# Altium schematic sheet Power.SchDoc
size A; SheetNumber: 3; SheetTotal: 3
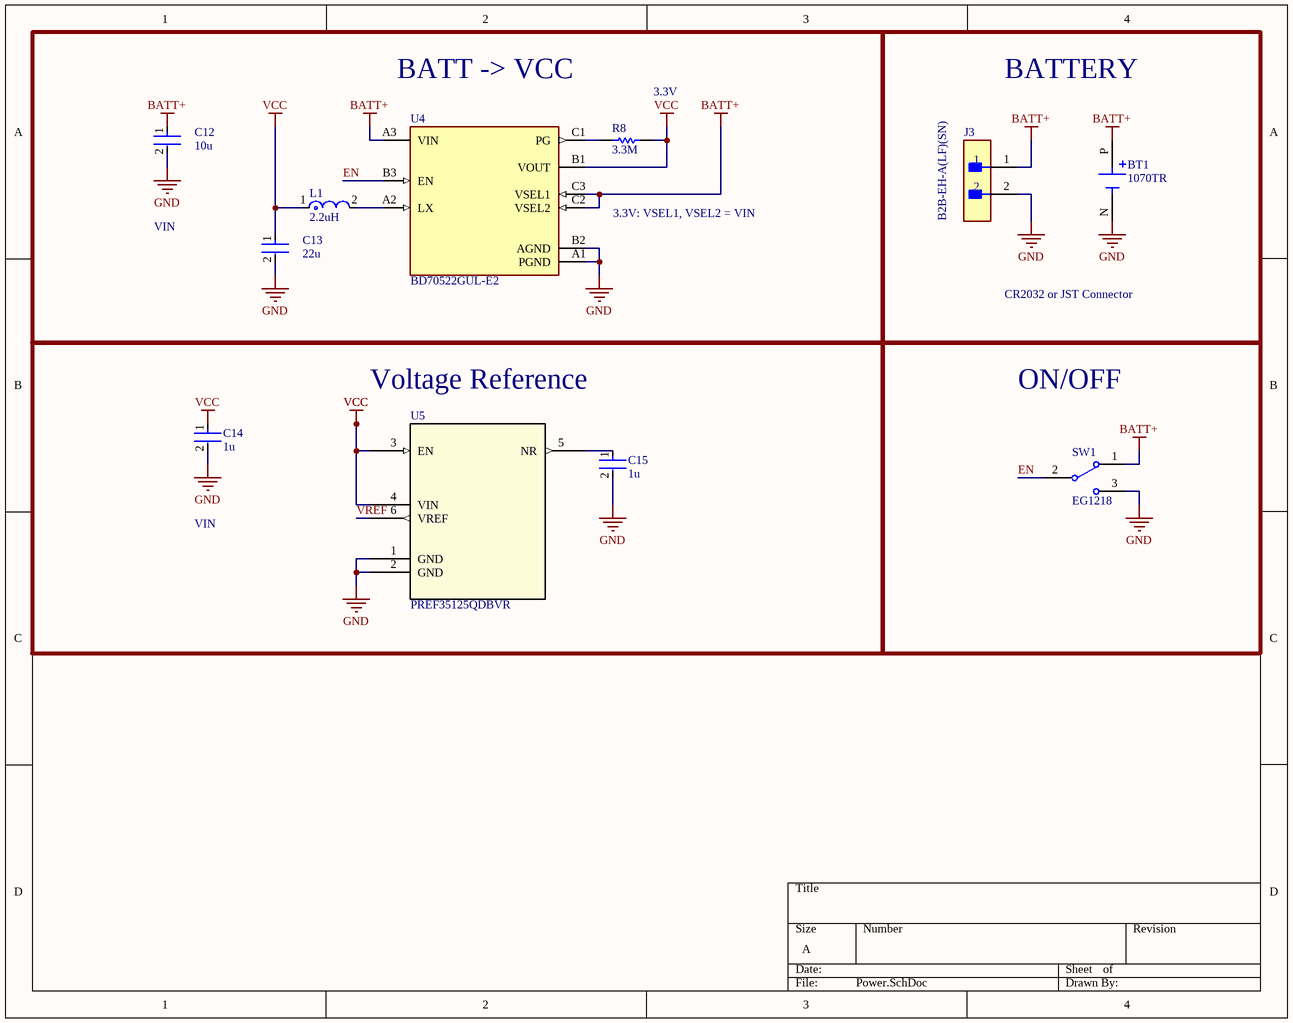
[diagram p0: Power.SchDoc]

## Parts
BT1  1070TR  [KEYSTONE_1070TR]
C12  10u  [FP-GCM31C-0_2-e0_3_0_8-IPC_A]
C13  22u  [FP-GRM32E-0_3-0_2-IPC_B]
C14  1u  [FP-GCM188-0_1-IPC_B]
C15  1u  [FP-GCM188-0_1-IPC_B]
J3  B2B-EH-A(LF)(SN)  [FP-B2B-EH-A_LF_SN-MFG]
L1  2.2uH  [FP-DG6050C-MFG]
R8  3.3M  [RESC1005X40X25NL05T10]
SW1  EG1218  [ESWI-EG1218_V]
U4  BD70522GUL-E2  [FP-VCSP50L1C-IPC_C]
U5  PREF35125QDBVR  [SOT23_DBV_TEX]

## Blocks framed on the sheet
BATT -> VCC: C12 C13 L1 R8 U4
BATTERY: BT1 J3
Voltage Reference: C14 C15 U5
ON/OFF: SW1

## Nets
BATT+: BT1.P(POS) C12.1 J3.1 SW1.1 U4.A3(VIN) U4.C2(VSEL2) U4.C3(VSEL1)
GND: BT1.N(NEG) C12.2 C13.2 C14.2 C15.2 J3.2 SW1.3 U4.A1(PGND) U4.B2(AGND) U5.1(GND) U5.2(GND)
VCC: C13.1 C14.1 L1.1 R8.2 U4.B1(VOUT) U5.3(EN) U5.4(VIN)
EN: SW1.2(COM) U4.B3(EN)
VREF: U5.6(VREF)
NetC15_1: C15.1 U5.5(NR)
NetL1_2: L1.2 U4.A2(LX)
NetR8_1: R8.1 U4.C1(PG)

## Notes on the sheet
- (near R8) 3.3V
- VIN
- 3.3V: VSEL1, VSEL2 = VIN
- CR2032 or JST Connector

## Library data of the parts
C12 = CMP-06035-027091-1: Ceramic Capacitor for Automotive 10uF ±10% 16VDC X7R 1206 Embossed T/R; Voltage Rating: 16V; Package Quantity: 6000; Mount: Surface Mount; Case Code (Metric): 3216; Width: 1.6mm; Capacitance: 10uF; Max Operating Temperature: 125°C; Length: 3.2mm; Case/Package: 1206; Depth: 1.6mm; Tolerance: 10%; Height: 1.6mm; Radiation Hardening: No; Voltage Rating (DC): 16V; Case Code (Imperial): 1206; Termination: SMD/SMT; Min Operating Temperature: -55°C; Dielectric: X7R; Packaging: Tape and Reel
C13 = CMP-06035-011048-1: Chip Multilayer Ceramic Capacitors for General Purpose, 1210, 22uF, X7R, 15%, 10%, 16V; Case Code (Metric): 3225; Case Code (Imperial): 1210; Capacitance: 22uF; Case/Package: 1210; Min Operating Temperature: -55°C; Tolerance: 10%; Resistor Type: Ceramic; Mount: Surface Mount; REACH SVHC: No SVHC; Dielectric: X7R; Packaging: Tape and Reel; Voltage: 16V; Voltage Rating (DC): 16V; Weight: 0.00388oz; Height: 2.5mm; Material: Ceramic; Voltage Rating: 16V; Width: 2.5mm; Max Operating Temperature: 125°C; Package Quantity: 1; Radiation Hardening: No; Length: 3.2mm; Depth: 1.6mm; Thickness: 0.106inch; Lead Free: Lead Free; Termination: SMD/SMT
C14 C15 = CMP-2006-02357-2: Ceramic Capacitor for Automotive 1uF  ±10% 16VDC X7R 0603 Paper T/R; Voltage: 16V; Thickness: 0.035inch; Width: 0.031inch; Radiation Hardening: No; Depth: 0.8mm; Max Operating Temperature: 125°C; Package Quantity: 1; Ratings: AEC-Q200; Min Operating Temperature: -55°C; Packaging: Tape and Reel; Case Code (Metric): 1608; REACH SVHC: No SVHC; Dielectric: X7R; Case Code (Imperial): 0603; Length: 1.6mm; Height: 0.8mm; Voltage Rating: 16V; Termination: SMD/SMT; Case/Package: 0603; Voltage Rating (DC): 16V; Tolerance: 10%; Capacitance: 1uF; Mount: Surface Mount; Lead Free: Lead Free
J3 = CMP-17439-000026-1: CONN HEADER VERT 2POS 2.5MM; Number of Contacts: 2; Current Rating: 3A; Connector Type: Plug; Contact Resistance: 20mR; Gender: Male; Voltage Rating: 250V; Fastening Type: Detent; Depth: 3.8mm; Max Operating Temperature: 85°C; Orientation: Straight; Series: EH; Contact Plating: Tin; Min Operating Temperature: -25°C; Contact Type: Male Pin; Housing Color: White; Termination: Press-Fit; Housing Material: Nylon; Pitch: 2.5mm; Number of Positions: 2; Max Current Rating: 3A; Packaging: Bulk; Lead Free: Lead Free; Number of Rows: 1; Length: 7.5mm; Contact Mating Length: 0.13inch; Color: Natural; Max Voltage Rating (AC): 250V; Contact Material: Copper Alloy; Mount: Through Hole
L1 = CMP-06042-016402-1: FIXED IND 2.2UH 7.8A 19.2 MOHM; Test Frequency: 100kHz; Core Material: Ferrite; DC Resistance (DCR): 19.2mR; Tolerance: 30%; Shielding: Shielded; Max DC Current: 5.3A; Case/Package: Nonstandard; Length: 0.248inch; RoHS Compliant: Yes; Packaging: Tape and Reel; Mount: Surface Mount; Height - Seated (Max): 0.198inch; Inductance: 2.2uH; Resistor Type: Wirewound; Width: 0.248inch; Current Rating: 7.8A
R8 = CMP-2002-07044-1: Manufacturer: Yageo / Phycomp; Part Number: RC0402FR-073M3L
SW1 = CMP-1696-00002-1: Slide Switch, 500 V, -20 to 70 degC, 3-Pin THD, RoHS; Case\Package: SOT-23-5; Output Current: 150 mA; Nominal Output Voltage: 3.3 V; Max Power Dissipation: 250 mW; Min Input Voltage: 4.3 V; Outputs: 1; Max Input Voltage: 8 V; Dropout Voltage: 300 mV; PackageDescription: 3-Pin Through Hole Device, Body 11.6 x 4 mm, Pitch 2.5 mm; ComponentLink1URL: http://www.e-switch.ch/en/; RoHSCompliant: true; Length: 3 mm; ComponentLink1Description: Manufacturer URL; Power Rating: 250 mW; Mount: Surface Mount; Max Operating Temperature: 85 degC; REACH SVHC: No SVHC; Radiation Hardening: No; Height: 1.3 mm; Pins: 5; Max Ouput Current: 150 mA; Output Voltage: 3.3 V; Width: 1.8 mm; Package Quantity: 3000; ComponentLink2URL: https://www.e-switch.com/system/asset/product_line/data_sheet/119/EG.pdf; Min Operating Temperature: -40 degC; ComponentLink2Description: Datasheet; DatasheetVersion: Oct-15; PackageReference: EG1218; Packaging: Tape and Reel
U4 = CMP-08938-000003-1: IC REG BUCK ADJ 500MA VCSP50L1; Manufacturer: Rohm; Output Type: AdjustableProgrammable; Max Power Dissipation: 0.592W; Number Of Outputs: 1; Output Voltage: 1.2/1.5/1.8/2.0/2.5/2.8/3.0/3.2/3.3V; Max Junction Temp: +150°C; Max Duty Cycle: 100%; Nominal Supply Current: 0.18uA; Max Supply Voltage: 5.5V; Switching Frequency: 1MHz; Standoff Height: 0.05mm; Min Supply Voltage: 2.5V; ComponentLink2Description: Datasheet; Device Class L3: Voltage Regulators - Switching; Switching Topology: Buck; Output Current: 500mA; Temperature Range High: +85°C; Digikey Description: IC REG BUCK ADJ 500MA VCSP50L1; Category: IC; Octopart: https://octopart.com/bd70522gul-e2-rohm-88248999; ComponentLink2URL: https://www.rohm.com/datasheet/BD70522GUL/bd70522gul-e; Device Class L2: Power Management ICs; Temperature Range Low: -40°C; RoHS: TRUE; Package: VCSP50L1C; Ipc Land Pattern Name: BGA9N50P3X3_156X176X56; Lead Free: Yes; Temperature: -40°C to +85°C; Device Class L1: Integrated Circuits (ICs); Height: 0.57mm; Automotive: No; Mouser Description: Ultra Low Iq Buck Converter 1MHz 500mA 1.2V to 3.3V Adjustable 50-Pin VCSP Emboss T/R; Manufacturer Part Number: BD70522GUL-E2
U5 = PREF35125QDBVR: 650-nA quiescent current, 12-ppm/°C drift, ultra-low-power precision voltage reference; Mfr_Name: Texas Instruments; RefDes: RefDes; Type: Type; Supplier 1: Digikey; Supplier Part Number 1: 296-REF35300QDBVRCT-ND
BT1 = 1070TR: Package: None; Availability: Unavailable; Value: *; MP: 1070TR; Price: None; Supplier 1: Digikey; Supplier Part Number 1: 36-1070CT-ND